# EAGLE schematic drivermos (EAGLE 9.6.2)
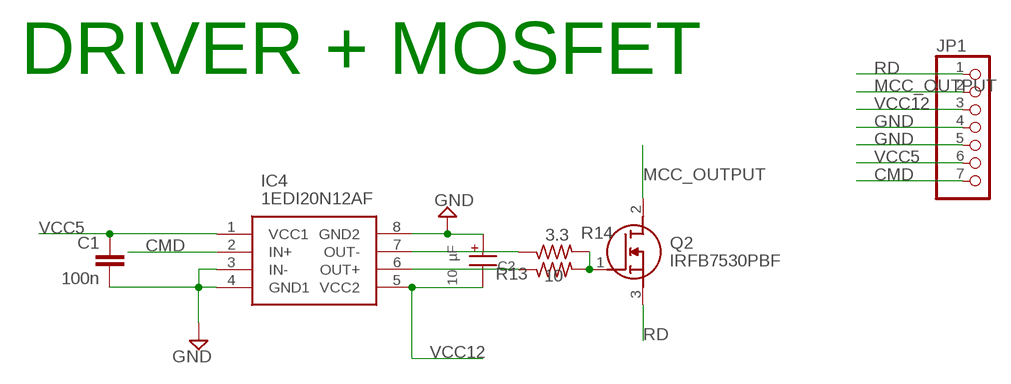
[diagram p0: schematic, sheet 1]

## Parts
C1  100n  C-EUC0805  [C0805]
C2  10 µF  WCAP-ASLI_6.3X7.7_865080845005  [WCAP-ASLI_6.3X7.7(DXL)]
IC4  1EDI20N12AF  [SOIC127P600X175-8N]
JP1  PINHD-1X7/90  [1X07/90]
Q2  IRFB7530PBF  [TO254P483X1016X1994-3P]
R13  10  R-US_R0603  [R0603]
R14  3.3  R-US_R0603  [R0603]

## Nets
CMD: IC4.2(IN+) JP1.7
GND: C2.1(+) IC4.3(IN-) IC4.8(GND2) JP1.4 JP1.5
MCC_OUTPUT: JP1.2 Q2.2(D)
N$1: IC4.6(OUT+) R13.1
N$2: IC4.7(OUT-) R14.1
N$7: C1.2 IC4.4(GND1)
N$18: Q2.1(G) R13.2 R14.2
RD: JP1.1 Q2.3(S)
VCC5: C1.1 IC4.1(VCC1) JP1.6
VCC12: C2.2(-) IC4.5(VCC2) JP1.3

## Notes on the sheet
- DRIVER + MOSFET

## Library data of the parts
C1 = rcl:C-EU: CAPACITOR, European symbol; SPICEPREFIX: C
C2 = Eagle_WCAP-ASLI (rev20a):WCAP-ASLI_6.3X7.7: WCAP-ASLI Aluminium Electrolytic Capacitors Low Impedance +105 °C Characteristics Low impedance product series Mounting style: V-Chip SMT Capacitance range: 0.1 µF ‒ 6800 µF Capacitance tolerance: ±20 % Voltage range (UR): 6.3 ‒ 100 V(DC) Operating temperature: -55 °C up to +105 °C Endurance: 2000 h @ +105 °C Dimensions (DxL) in mm: 4.0 x 5.5 up to 16.0 x 17.0 Recommended soldering: Reflow soldering Applications Low impedance, especially for filtering applications Input and output capacitor for switched-mode power supply Filtering Smoothing e.g. DC/DC converter, AC/DC converter, satellite receiver, control panel <https://www.we-online.com/catalog/media/o14723v209%20Family_WCAP-ASLI.jpg> Details see: https://www.we-online.com/catalog/en/WCAP-ASLI/ Updated by yingchun,Shan;2020-03-03 2020(C) Würth Elektronik; DATASHEET-URL: https://www.we-online.com/catalog/datasheet/865080845005.pdf; DF: 10%; DIAMETER: 6.3mm; I-LEAK: 10uA; I-RIPPLE: 35mA; L: 7.7mm; OPERATING-TEMPERATURE: -55 °C up to +105 °C; PART-NUMBER: 865080845005; TECHNICAL-REFERENCE: ASED077100M100DVCTCB000; VR: 100V(DC)
IC4 = 1EDI20N12AF:1EDI20N12AF: Gate Drivers 1200V Isolated 1-CH, 3.5A,Separate Output Source: Datasheet <https://componentsearchengine.com/Datasheets/1/1EDI20N12AF.pdf>; DESCRIPTION: Gate Drivers 1200V Isolated 1-CH, 3.5A,Separate Output; HEIGHT: 1.75mm; MANUFACTURER_NAME: Infineon; MANUFACTURER_PART_NUMBER: 1EDI20N12AF; MOUSER_PART_NUMBER: 726-1EDI20N12AF; MOUSER_PRICE-STOCK: https://www.mouser.co.uk/ProductDetail/Infineon-Technologies/1EDI20N12AF?qs=Fdzd9GSp%252BASr8JSo1G1nbg%3D%3D
JP1 = pinhead:PINHD-1X7: PIN HEADER
Q2 = IRFB7530PBF:IRFB7530PBF: Infineon IRFB7530PBF N-channel MOSFET, 195 A, 60 V StrongIRFET, 3-Pin TO-220AB Source: Datasheet <https://www.infineon.com/dgdl/irfs7530pbf.pdf?fileId=5546d462533600a4015364c3d98429c3>; ARROW_PART_NUMBER: IRFB7530PBF; ARROW_PRICE-STOCK: https://www.arrow.com/en/products/irfb7530pbf/infineon-technologies-ag; DESCRIPTION: Infineon IRFB7530PBF N-channel MOSFET, 195 A, 60 V StrongIRFET, 3-Pin TO-220AB; HEIGHT: 4.83mm; MANUFACTURER_NAME: Infineon; MANUFACTURER_PART_NUMBER: IRFB7530PBF; MOUSER_PART_NUMBER: 942-IRFB7530PBF; MOUSER_PRICE-STOCK: https://www.mouser.co.uk/ProductDetail/Infineon-IR/IRFB7530PBF?qs=a7rcPCEf1Q%2FFGrR%252BNclv%2FQ%3D%3D
R13 R14 = rcl:R-US_: RESISTOR, American symbol; SPICEPREFIX: R